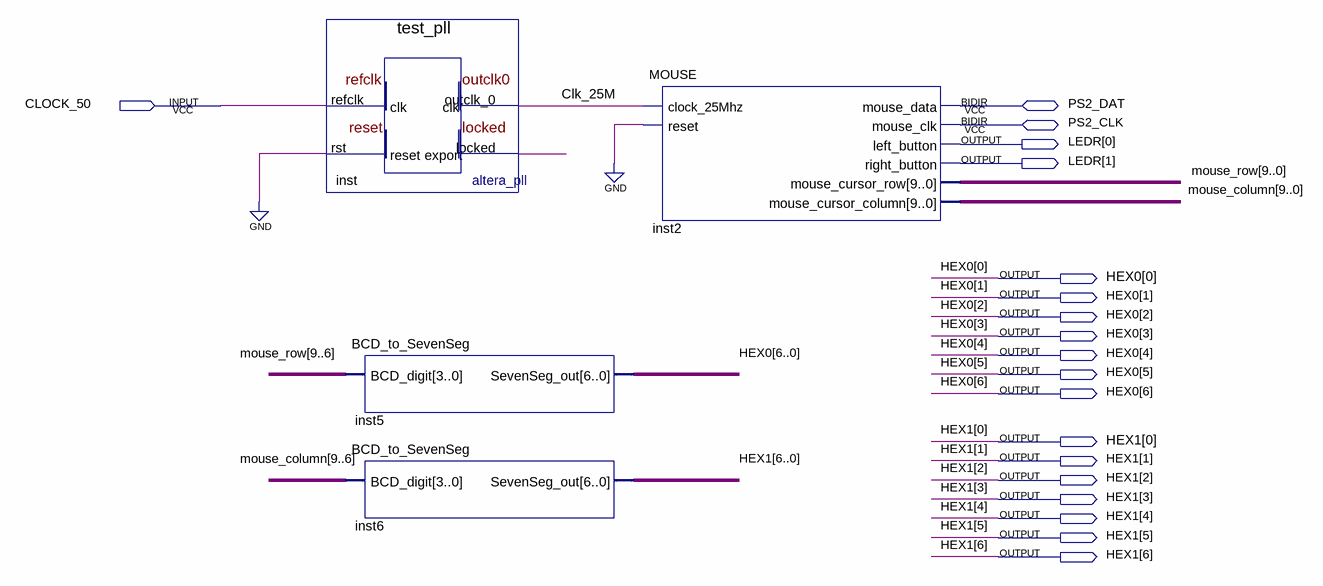
[diagram p0: schematic sheet]
// Quartus schematic MouseTest.bdf as structural Verilog: 4 symbols, 19 pins
module MouseTest (
  input  CLOCK_50,
  inout  PS2_DAT,
  inout  PS2_CLK,
  output [1:0] LEDR,
  output [6:0] HEX0,
  output [6:0] HEX1
);

  wire Clk_25M, inst_locked;
  wire [9:0] mouse_column, mouse_row;

  test_pll inst (.refclk(CLOCK_50), .rst(1'b0), .outclk_0(Clk_25M), .locked(inst_locked));
  BCD_to_SevenSeg inst5 (.BCD_digit(mouse_row[9:6]), .SevenSeg_out(HEX0));
  BCD_to_SevenSeg inst6 (.BCD_digit(mouse_column[9:6]), .SevenSeg_out(HEX1));
  MOUSE inst2 (
    .clock_25Mhz(Clk_25M), .reset(1'b0), .left_button(LEDR[0]), .right_button(LEDR[1]),
    .mouse_cursor_row(mouse_row), .mouse_cursor_column(mouse_column), .mouse_data(PS2_DAT),
    .mouse_clk(PS2_CLK));
endmodule
